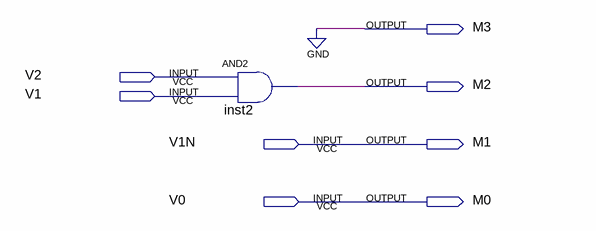
[diagram p0: schematic sheet]
// Quartus schematic circuitA.bdf as structural Verilog: 1 symbols, 8 pins
module circuitA (
  input  V2,
  input  V1,
  input  V1N,
  input  V0,
  output M3,
  output M2,
  output M1,
  output M0
);

  and inst2 (M2, V2, V1);

  assign M0 = V0;
  assign M1 = V1N;
  assign M3 = 1'b0;
endmodule
